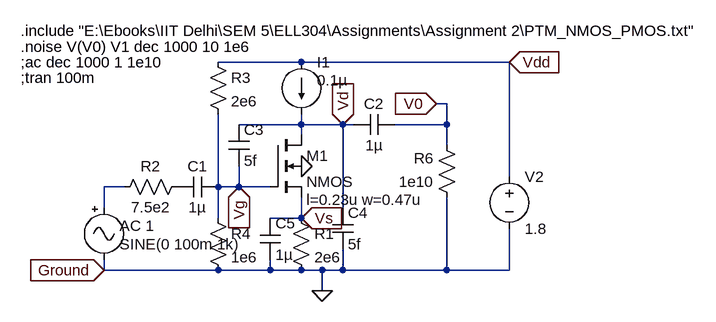
[diagram p0: schematic Q2.asc]
Q2.asc, the LTspice schematic file:
Version 4
SHEET 1 900 680
WIRE 192 0 64 0
WIRE 512 0 192 0
WIRE 416 64 400 64
WIRE 192 96 192 80
WIRE 192 96 96 96
WIRE 256 96 192 96
WIRE 272 96 256 96
WIRE 416 96 416 64
WIRE 416 96 336 96
WIRE 192 112 192 96
WIRE 416 128 416 96
WIRE 512 176 512 0
WIRE -80 192 -112 192
WIRE 64 192 64 80
WIRE 96 192 96 160
WIRE 96 192 64 192
WIRE 144 192 96 192
WIRE -112 224 -112 192
WIRE 256 224 256 96
WIRE 64 240 64 192
WIRE 192 240 192 208
WIRE 192 240 144 240
WIRE -112 320 -112 304
WIRE 64 320 -112 320
WIRE 144 320 144 304
WIRE 144 320 64 320
WIRE 192 320 144 320
WIRE 224 320 192 320
WIRE 256 320 256 288
WIRE 256 320 224 320
WIRE 416 320 416 208
WIRE 416 320 256 320
WIRE 512 320 512 256
WIRE 512 320 416 320
WIRE 224 352 224 320
FLAG 400 64 V0
IOPIN 400 64 In
FLAG 224 352 0
FLAG 192 160 0
FLAG 96 192 Vg
IOPIN 96 192 In
FLAG 192 240 Vs
IOPIN 192 240 In
FLAG 256 96 Vd
IOPIN 256 96 In
FLAG 512 0 Vdd
IOPIN 512 0 In
FLAG -112 320 Ground
IOPIN -112 320 In
SYMBOL nmos4 144 112 R0
WINDOW 123 56 100 Left 2
SYMATTR Value2 l=0.23u w=0.47u
SYMATTR InstName M1
SYMBOL res 48 -16 R0
SYMATTR InstName R3
SYMATTR Value 2e6
SYMBOL res 48 224 R0
SYMATTR InstName R4
SYMATTR Value 1e6
SYMBOL cap 64 176 R90
WINDOW 0 0 32 VBottom 2
WINDOW 3 32 32 VTop 2
SYMATTR InstName C1
SYMATTR Value 1µ
SYMBOL cap 336 80 R90
WINDOW 0 0 32 VBottom 2
WINDOW 3 32 32 VTop 2
SYMATTR InstName C2
SYMATTR Value 1µ
SYMBOL res 432 224 R180
WINDOW 0 36 76 Left 2
WINDOW 3 36 40 Left 2
SYMATTR InstName R6
SYMATTR Value 1e10
SYMBOL Misc\\signal -112 208 R0
WINDOW 123 24 44 Left 2
WINDOW 39 0 0 Left 0
WINDOW 0 24 16 Invisible 2
WINDOW 3 24 72 Left 2
SYMATTR Value2 AC 1
SYMATTR InstName V1
SYMATTR Value SINE(0 100m 1k)
SYMBOL voltage 512 160 R0
WINDOW 123 0 0 Left 0
WINDOW 39 0 0 Left 0
SYMATTR InstName V2
SYMATTR Value 1.8
SYMBOL cap 240 224 R0
SYMATTR InstName C4
SYMATTR Value 5f
SYMBOL res 176 224 R0
SYMATTR InstName R1
SYMATTR Value 2e6
SYMBOL current 192 0 R0
WINDOW 3 24 28 Left 2
WINDOW 123 0 0 Left 0
WINDOW 39 0 0 Left 0
SYMATTR Value 0.1µ
SYMATTR InstName I1
SYMBOL cap 128 240 R0
SYMATTR InstName C5
SYMATTR Value 1µ
SYMBOL res 16 176 R90
WINDOW 0 0 56 VBottom 2
WINDOW 3 32 56 VTop 2
SYMATTR InstName R2
SYMATTR Value 7.5e2
SYMBOL cap 80 96 R0
SYMATTR InstName C3
SYMATTR Value 5f
TEXT -240 -24 Left 2 !.noise V(V0) V1 dec 1000 10 1e6
TEXT -240 -48 Left 2 !.include "E:\\Ebooks\\IIT Delhi\\SEM 5\\ELL304\\Assignments\\Assignment 2\\PTM_NMOS_PMOS.txt"
TEXT -240 0 Left 2 !;ac dec 1000 1 1e10
TEXT -240 24 Left 2 !;tran 100m

The netlist it stands for:
* Q2.asc
M1 Vd Vg Vs 0 NMOS l=0.23u w=0.47u
R3 Vdd Vg 2e6
R4 Vg 0 1e6
C1 Vg P001 1µ
C2 V0 Vd 1µ
R6 0 V0 1e10
V1 N001 0 SINE(0 100m 1k) AC 1
V2 Vdd 0 1.8
C4 Vd 0 5f
R1 Vs 0 2e6
I1 Vdd Vd 0.1µ
C5 Vs 0 1µ
R2 P001 N001 7.5e2
C3 Vd Vg 5f
.model NMOS NMOS
.model PMOS PMOS
.lib standard.mos
.noise V(V0) V1 dec 1000 10 1e6
.include "E:\Ebooks\IIT Delhi\SEM 5\ELL304\Assignments\Assignment 2\PTM_NMOS_PMOS.txt"
;ac dec 1000 1 1e10
;tran 100m
.backanno
.end